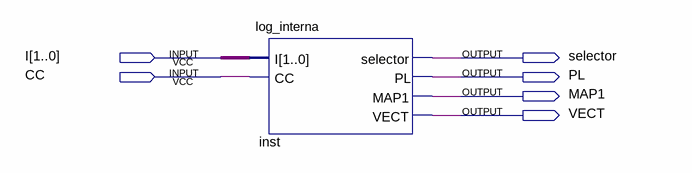
[diagram p0: schematic sheet]
// Quartus schematic logint.bdf as structural Verilog: 1 symbols, 6 pins
module logint (
  input  [1:0] I,
  input  CC,
  output selector,
  output PL,
  output MAP1,
  output VECT
);

  log_interna inst (.I(I), .CC(CC), .selector(selector), .PL(PL), .MAP1(MAP1), .VECT(VECT));
endmodule
